# EAGLE design avrBetterSTK200 (EAGLE 7.1.0)
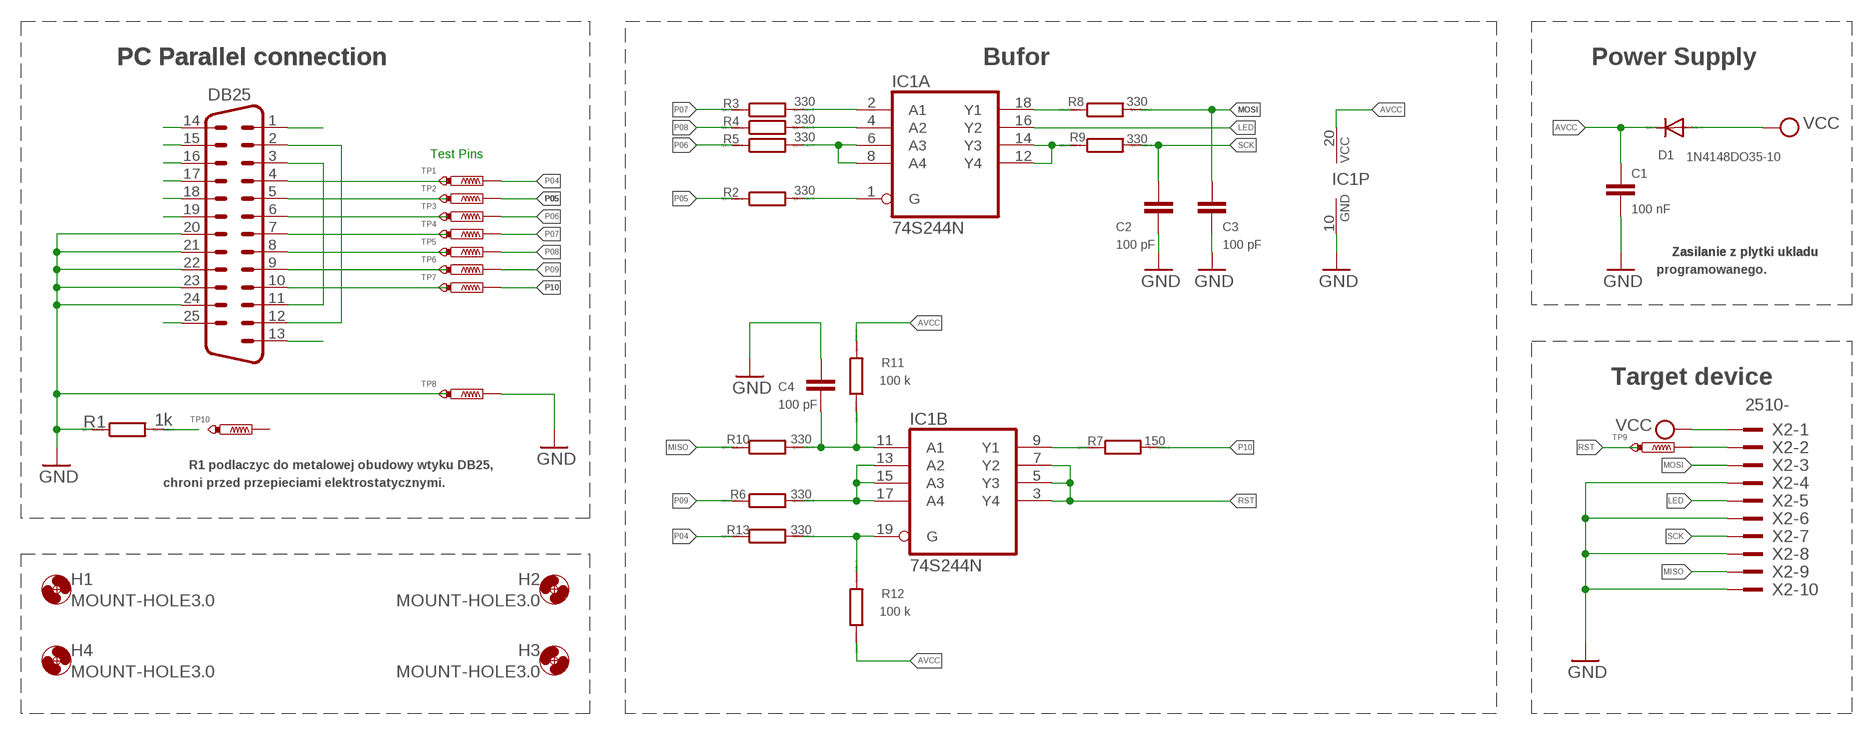
[diagram p0: schematic, sheet 1]

## Parts
C1  100 nF  C-EU050-035X075  [C050-035X075]
C2  100 pF  C-EU050-035X075  [C050-035X075]
C3  100 pF  C-EU050-035X075  [C050-035X075]
C4  100 pF  C-EU050-035X075  [C050-035X075]
D1  1N4148DO35-10  [DO35-10]
DB25  M25V  [M25V]
H1  MOUNT-HOLE3.0  [3,0]
H2  MOUNT-HOLE3.0  [3,0]
H3  MOUNT-HOLE3.0  [3,0]
H4  MOUNT-HOLE3.0  [3,0]
IC1  74S244N  [DIL20]
R1  1k  R-EU_0207_10  [0207/10]
R2  330  R-EU_0207_10  [0207/10]
R3  330  R-EU_0207_10  [0207/10]
R4  330  R-EU_0207_10  [0207/10]
R5  330  R-EU_0207_10  [0207/10]
R6  330  R-EU_0207_10  [0207/10]
R7  150  R-EU_0207_10  [0207/10]
R8  330  R-EU_0207_10  [0207/10]
R9  330  R-EU_0207_10  [0207/10]
R10  330  R-EU_0207_10  [0207/10]
R11  100 k  R-EU_0207_10  [0207/10]
R12  100 k  R-EU_0207_10  [0207/10]
R13  330  R-EU_0207_10  [0207/10]
TP1  PTR1PAD1-17Y  [P1-17Y]
TP2  PTR1PAD1-17Y  [P1-17Y]
TP3  PTR1PAD1-17Y  [P1-17Y]
TP4  PTR1PAD1-17Y  [P1-17Y]
TP5  PTR1PAD1-17Y  [P1-17Y]
TP6  PTR1PAD1-17Y  [P1-17Y]
TP7  PTR1PAD1-17Y  [P1-17Y]
TP8  PTR1PAD1-17Y  [P1-17Y]
TP9  PTR1PAD1-17Y  [P1-17Y]
TP10  PTR1PAD1-17Y  [P1-17Y]
X2  2510-  [PAK100/2500-10]

## Nets
AVCC: C1.1 D1.C IC1.20(P:VCC) R11.2 R12.1
GND: C1.2 C2.2 C3.2 C4.1 DB25.20 DB25.21 DB25.22 DB25.23 DB25.24 IC1.10(P:GND) R1.1 TP8.TP X2.4 X2.6 X2.8 X2.10
LED: IC1.16(A:Y2) X2.5
MISO: R10.1 X2.9
MOSI: C3.1 R8.2 X2.3
N$1: DB25.2 DB25.12
N$2: DB25.3 DB25.11
N$12: IC1.1(A:G) R2.2
N$13: IC1.6(A:A3) IC1.8(A:A4) R5.2
N$15: IC1.4(A:A2) R4.2
N$16: IC1.2(A:A1) R3.2
N$28: IC1.9(B:Y1) R7.1
N$31: IC1.13(B:A2) IC1.15(B:A3) IC1.17(B:A4) R6.2
N$32: IC1.18(A:Y1) R8.1
N$35: IC1.12(A:Y4) IC1.14(A:Y3) R9.1
N$36: C4.2 IC1.11(B:A1) R10.2 R11.1
N$40: IC1.19(B:G) R12.2 R13.2
P04: R13.1 TP1.TP
P05: R2.1 TP2.TP
P06: R5.1 TP3.TP
P07: R3.1 TP4.TP
P08: R4.1 TP5.TP
P09: R6.1 TP6.TP
P10: R7.2 TP7.TP
PAD1: DB25.14
PAD2: DB25.15
PAD3: DB25.16
PAD4: DB25.17
PAD5: DB25.18
PAD6: DB25.19
PAD7: DB25.25
PAD8: DB25.1
PAD9: DB25.13
RST: IC1.3(B:Y4) IC1.5(B:Y3) IC1.7(B:Y2) TP9.TP X2.2
SCK: C2.1 R9.2 X2.7
TP1: DB25.4
TP2: DB25.5
TP3: DB25.6
TP4: DB25.7
TP5: DB25.8
TP6: DB25.9
TP7: DB25.10
TP10: R1.2
VCC: D1.A X2.1
Unconnected: TP10.TP

## Notes on the sheet
- PC Parallel connection | PC Parallel connection | Bufor | Power Supply
- Test Pins
- Zasilanie z plytki ukladu | Zasilanie z plytki ukladu
- programowanego.
- Target device
- R1 podlaczyc do metalowej obudowy wtyku DB25,
- chroni przed przepieciami elektrostatycznymi.

## Library data of the parts
C1-C4 = rcl:C-EU: CAPACITOR, European symbol
D1 = diode:1N4148: DIODE high speed (Philips)
DB25 = con-subd:M25: SUB-D; OC_FARNELL: unknown; OC_NEWARK: unknown
H1-H4 = holes:MOUNT-HOLE: MOUNTING HOLE with drill center marker
IC1 = 74xx-eu:74*244: Octal BUFFER and LINE DRIVER, 3-state
R1-R13 = resistor:R-EU_: RESISTOR, European symbol; SPICEPREFIX: R
TP1-TP10 = testpad:PTR1: TEST PIN
X2 = con-3m:2510-: 3M (TM) Pak 100 4-Wall Header Source: 3M; MF: 3M; MPN: 2510-6002UB; OC_FARNELL: 9838244; OC_NEWARK: 46F4725

## Board
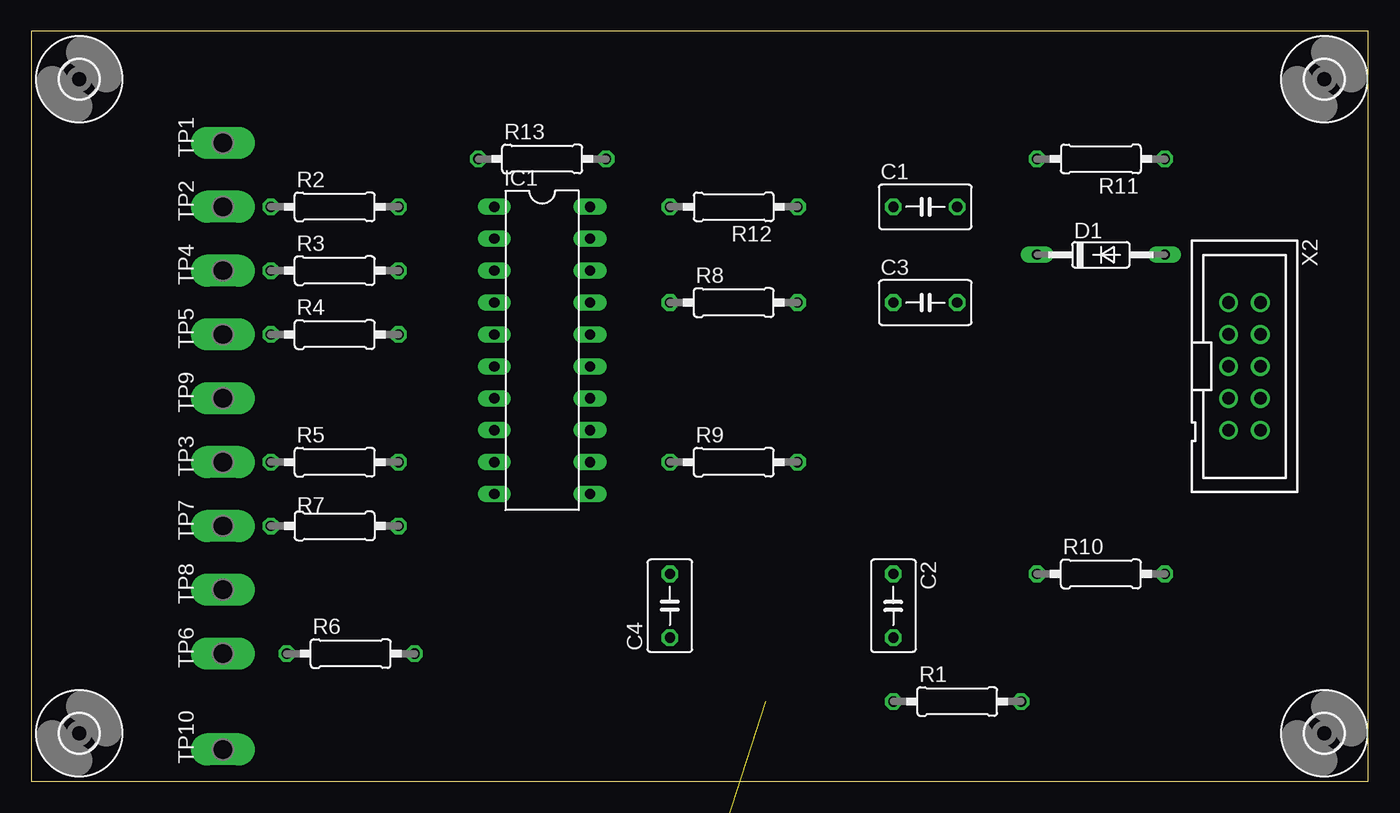
[diagram p1: board, top side]
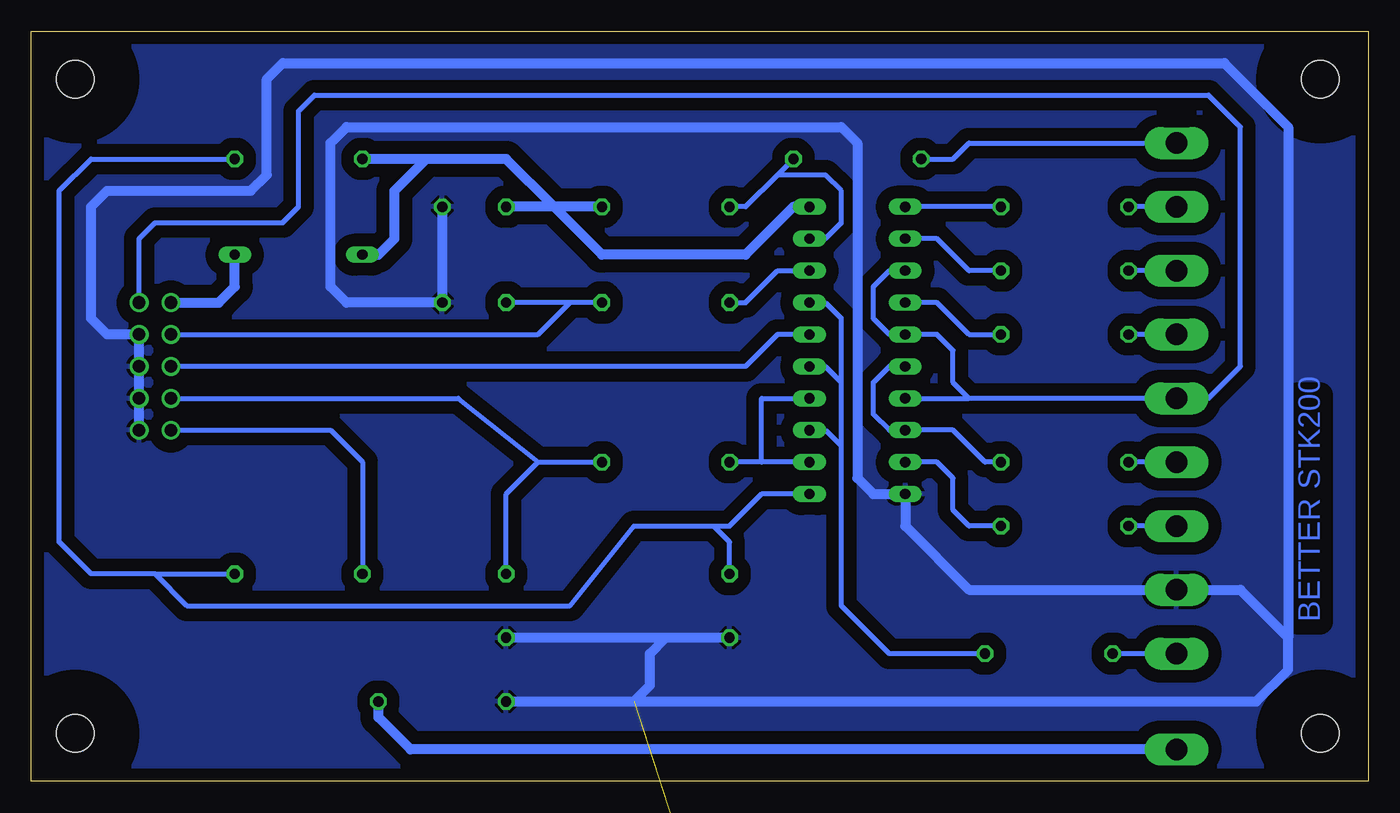
[diagram p2: board, bottom side, seen from below]

Size 106.35 x 59.68 mm. Coordinates in mm from the lower left corner, seen from the top.
Outline: 0,0 106.35,0 106.35,59.68 0,59.68 0,0
Copper layers (1*16): Top 0.035mm / dielectric 1.5mm / Bottom 0.035mm
Design rules "default": minimum track width 10mil, minimum drill 24mil, track to track 8mil, track to pad 8mil, pad to pad 8mil, via to via 8mil, smd to smd 8mil, copper to edge 40mil, drill to drill 8mil, minimum pad ring 10mil, minimum via ring 8mil, stop-mask expansion 4mil, vias tented up to drill 0mil, thermal gap 10mil

### Footprints (pad centres in the part's own frame; a part is rotated, then mirrored left to right if it is on the bottom)
C050-035X075 = drill 0.813 octagon: 1 -2.54,0; 2 2.54,0
DO35-10 = drill 0.813 long: A 5.08,0; C -5.08,0
M25V = drill 1.016 octagon: 1 -16.561,1.422; 2 -13.792,1.422; 3 -11.049,1.422; 4 -8.28,1.422; 5 -5.512,1.422; 6 -2.769,1.422; 7 0,1.422; 8 2.769,1.422; 9 5.512,1.422; 10 8.28,1.422; 11 11.049,1.422; 12 13.792,1.422; 13 16.561,1.422; 14 -15.189,-1.422; 15 -12.421,-1.422; 16 -9.652,-1.422; 17 -6.909,-1.422; 18 -4.14,-1.422; 19 -1.372,-1.422; 20 1.372,-1.422; 21 4.14,-1.422; 22 6.909,-1.422; 23 9.652,-1.422; 24 12.421,-1.422; 25 15.189,-1.422 | hole 3.302: 23.52,0; -23.52,0
3,0 = hole 3: 0,0
DIL20 = drill 0.813 long: 1 -11.43,-3.81; 2 -8.89,-3.81; 3 -6.35,-3.81; 4 -3.81,-3.81; 5 -1.27,-3.81; 6 1.27,-3.81; 7 3.81,-3.81; 8 6.35,-3.81; 9 8.89,-3.81; 10 11.43,-3.81; 11 11.43,3.81; 12 8.89,3.81; 13 6.35,3.81; 14 3.81,3.81; 15 1.27,3.81; 16 -1.27,3.81; 17 -3.81,3.81; 18 -6.35,3.81; 19 -8.89,3.81; 20 -11.43,3.81
0207/10 = drill 0.813 octagon: 1 -5.08,0; 2 5.08,0
P1-17Y = drill 1.702 pad 2.121 long: TP 0,0
PAK100/2500-10 = drill 1 pad 1.422: 1 -5.08,-1.27; 2 -5.08,1.27; 3 -2.54,-1.27; 4 -2.54,1.27; 5 0,-1.27; 6 0,1.27; 7 2.54,-1.27; 8 2.54,1.27; 9 5.08,-1.27; 10 5.08,1.27

### Placement (x,y rotation side)
C1  71.12,45.72 0 top
C2  68.58,13.97 270 top
C3  71.12,38.1 0 top
C4  50.8,13.97 90 top
D1  85.09,41.91 0 top
DB25  39.37,-12.7 0 top  (outside the outline)
H1  102.87,3.81 0 top
H2  102.87,55.88 0 top
H3  3.81,3.81 0 top
H4  3.81,55.88 0 top
IC1  40.64,34.29 270 top
R1  73.66,6.35 0 top
R2  24.13,45.72 0 top
R3  24.13,40.64 0 top
R4  24.13,35.56 0 top
R5  24.13,25.4 0 top
R6  25.4,10.16 0 top
R7  24.13,20.32 180 top
R8  55.88,38.1 0 top
R9  55.88,25.4 0 top
R10  85.09,16.51 0 top
R11  85.09,49.53 180 top
R12  55.88,45.72 180 top
R13  40.64,49.53 0 top
TP1  15.24,50.8 90 top
TP2  15.24,45.72 90 top
TP3  15.24,25.4 90 top
TP4  15.24,40.64 90 top
TP5  15.24,35.56 90 top
TP6  15.24,10.16 90 top
TP7  15.24,20.32 90 top
TP8  15.24,15.24 90 top
TP9  15.24,30.48 90 top
TP10  15.24,2.54 90 top
X2  96.52,33.02 270 top

### Tracks (layer width: path | path; a pad name or v marks a point on that pad's centre or on a via)
AVCC
  Bottom 0.813: R12.1 64.77,45.72 | 64.77,45.72 C1.1 | 64.77,45.72 60.96,41.91 49.53,41.91 45.72,45.72 IC1.20 | 64.77,45.72 68.58,49.53 74.93,49.53 | 74.93,49.53 R11.2 | D1.C 78.74,41.91 77.47,43.18 77.47,46.99 74.93,49.53
GND  (5 unrouted)
  Bottom 0.813: C1.2 C3.2 81.28,38.1 82.55,39.37 82.55,50.8 81.28,52.07 41.91,52.07 40.64,50.8 40.64,24.13 39.37,22.86 IC1.10 36.83,20.32 31.75,15.24 TP8.TP 10.16,15.24 6.35,11.43 | X2.10 X2.8 X2.6 X2.4 100.33,35.56 101.6,36.83 101.6,45.72 100.33,46.99 88.9,46.99 87.63,48.26 87.63,55.88 86.36,57.15 11.43,57.15 6.35,52.07 6.35,11.43 | R1.1 58.42,6.35 | C4.1 55.88,11.43 | 55.88,11.43 C2.2 | 58.42,6.35 57.15,7.62 57.15,10.16 55.88,11.43 | 58.42,6.35 8.89,6.35 6.35,8.89 6.35,11.43
  pour Bottom (isolate 1.016): 0,59.69 106.68,59.69 106.68,0 0,0 0,1.27
LED
  Bottom 0.406: IC1.16 46.99,35.56 49.53,33.02 X2.5
MISO
  Bottom 0.406: X2.9 82.55,27.94 80.01,25.4 R10.1
MOSI
  Bottom 0.406: R8.2 63.5,38.1 | 63.5,38.1 C3.1 | X2.3 66.04,35.56 63.5,38.1
N$1  (1 unrouted)
N$2  (1 unrouted)
N$12
  Bottom 0.406: R2.2 IC1.1
N$13
  Bottom 0.406: IC1.6 38.1,33.02 39.37,31.75 39.37,29.21 38.1,27.94 IC1.8 33.02,27.94 30.48,25.4 R5.2
N$15
  Bottom 0.406: IC1.4 34.29,38.1 31.75,35.56 R4.2
N$16
  Bottom 0.406: R3.2 31.75,40.64 34.29,43.18 IC1.2
N$28
  Bottom 0.406: R7.1 31.75,20.32 33.02,21.59 33.02,24.13 34.29,25.4 IC1.9
N$31
  Bottom 0.406: R6.2 38.1,10.16 41.91,13.97 41.91,26.67 | 41.91,26.67 41.91,31.75 | 41.91,31.75 41.91,36.83 43.18,38.1 IC1.17 | IC1.15 43.18,33.02 41.91,31.75 | IC1.13 43.18,27.94 41.91,26.67
N$32
  Bottom 0.406: R8.1 49.53,38.1 46.99,40.64 IC1.18
N$35
  Bottom 0.406: IC1.12 48.26,25.4 | 48.26,25.4 R9.1 | 48.26,25.4 48.26,30.48 IC1.14
N$36
  Bottom 0.406: 96.52,16.51 R10.2 | IC1.11 48.26,22.86 50.8,20.32 52.07,20.32 | 52.07,20.32 58.42,20.32 63.5,13.97 93.98,13.97 96.52,16.51 | C4.2 50.8,19.05 52.07,20.32 | 96.52,16.51 101.6,16.51 104.14,19.05 104.14,46.99 101.6,49.53 R11.1
N$40
  Bottom 0.406: IC1.19 43.18,43.18 41.91,44.45 41.91,46.99 43.18,48.26 46.99,48.26 | R13.2 46.99,48.26 | 46.99,48.26 49.53,45.72 R12.2
P04
  Bottom 0.406: R13.1 33.02,49.53 31.75,50.8 TP1.TP
P05
  Bottom 0.406: TP2.TP R2.1
P06
  Bottom 0.406: TP3.TP R5.1
P07
  Bottom 0.406: TP4.TP R3.1
P08
  Bottom 0.406: TP5.TP R4.1
P09
  Bottom 0.406: TP6.TP R6.1
P10
  Bottom 0.406: TP7.TP R7.2
RST
  Bottom 0.406: 31.75,30.48 TP9.TP 12.7,30.48 10.16,33.02 10.16,52.07 12.7,54.61 83.82,54.61 85.09,53.34 85.09,45.72 86.36,44.45 96.52,44.45 97.79,43.18 X2.2 | IC1.3 38.1,40.64 39.37,39.37 39.37,36.83 38.1,35.56 IC1.5 34.29,35.56 33.02,34.29 33.02,31.75 31.75,30.48 | IC1.7 31.75,30.48
SCK
  Bottom 0.406: X2.7 72.39,30.48 66.04,25.4 | 66.04,25.4 R9.2 | C2.1 68.58,22.86 66.04,25.4
TP10
  Bottom 0.813: 13.97,2.54 76.2,2.54 78.74,5.08 R1.2
VCC
  Bottom 0.813: X2.1 91.44,38.1 90.17,39.37 D1.A

### Text on the board
Bottom: BETTER STK200